# EAGLE design LEDs (EAGLE 9.6.2)
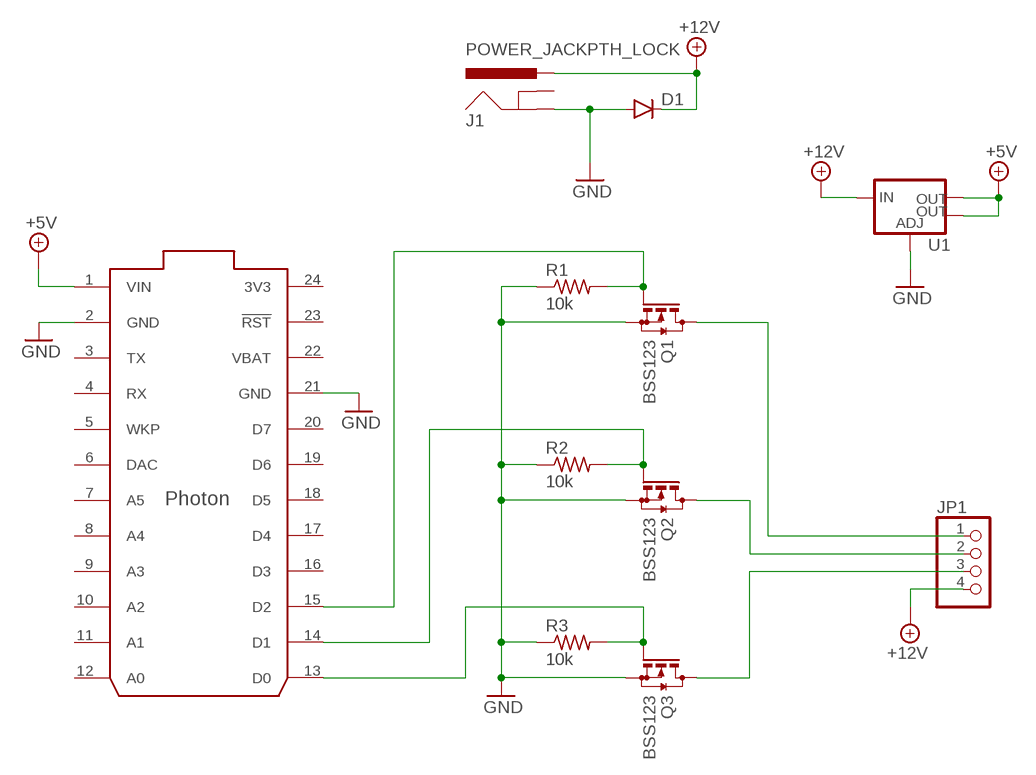
[diagram p0: schematic, sheet 1]

## Parts
D1  DIODESMA  [SMA-DIODE]
J1  POWER_JACKPTH_LOCK  [POWER_JACK_PTH_LOCK]
JP1  PINHD-1X4/90  [1X04/90]
Q1  BSS123  [SOT23]
Q2  BSS123  [SOT23]
Q3  BSS123  [SOT23]
R1  10k  R-US_M0805  [M0805]
R2  10k  R-US_M0805  [M0805]
R3  10k  R-US_M0805  [M0805]
U1  V_REG_LM1117SOT223  [SOT223]
U$1  PHOTON_WITH_HEADERS  [PHOTON]

## Nets
+5V: U1.2(OUT) U1.4(OUT) U$1.1(VIN)
+12V: D1.C J1.PWR JP1.4 U1.3(IN)
GND: D1.A J1.GND Q1.2(S) Q2.2(S) Q3.2(S) R1.1 R2.1 R3.1 U1.1(ADJ) U$1.2(GND) U$1.21(GND)
N$1: Q1.1(G) R1.2 U$1.15(D2)
N$2: Q2.1(G) R2.2 U$1.14(D1)
N$3: Q3.1(G) R3.2 U$1.13(D0)
N$4: JP1.3 Q3.3(D)
N$5: JP1.2 Q2.3(D)
N$6: JP1.1 Q1.3(D)
Unconnected: J1.GNDBREAK U$1.3(TX) U$1.4(RX) U$1.5(WKP) U$1.6(DAC) U$1.7(A5) U$1.8(A4) U$1.9(A3) U$1.10(A2) U$1.11(A1) U$1.12(A0) U$1.16(D3) U$1.17(D4) U$1.18(D5) U$1.19(D6) U$1.20(D7) U$1.23(!RST)

## Power pins joined to a net without a drawn wire
3V3: U$1.24(3V3)
VBAT: U$1.22(VBAT)

## Library data of the parts
D1 = SparkFun-DiscreteSemi:DIODE: Diode These are standard reverse protection diodes and small signal diodes. SMA package can handle up to about 1A. SOD-323 can handle about 200mA. What the SOD-323 package when ordering, there are some mfgs out there that are 5-pin packages.
J1 = Spark:POWER_JACK: Power Jack This is the standard 5.5mm barrel jack for power. The PTH is the most common, proven, reliable, footprint. The Slot footprint only works if the mill layer is transmitted to the PCB fab house so be warned. Spark Fun Electronics SKU : PRT-00119 SMT: CONN-08106 Mating wall wart : TOL-00298 (and others)
JP1 = pinhead:PINHD-1X4: PIN HEADER
Q1-Q3 = transistor-small-signal:BSS123: N-CHANNEL MOS FET
R1-R3 = resistor:R-US_: RESISTOR, American symbol
U1 = SparkFun-PowerIC:V_REG_LM1117: Voltage Regulator LM1117 Standard adjustable voltage regulator but in SMD form. Spark Fun Electronics SKU : COM-00595; PROD_ID: VREG-08170
U$1 = Spark:PHOTON

## Board
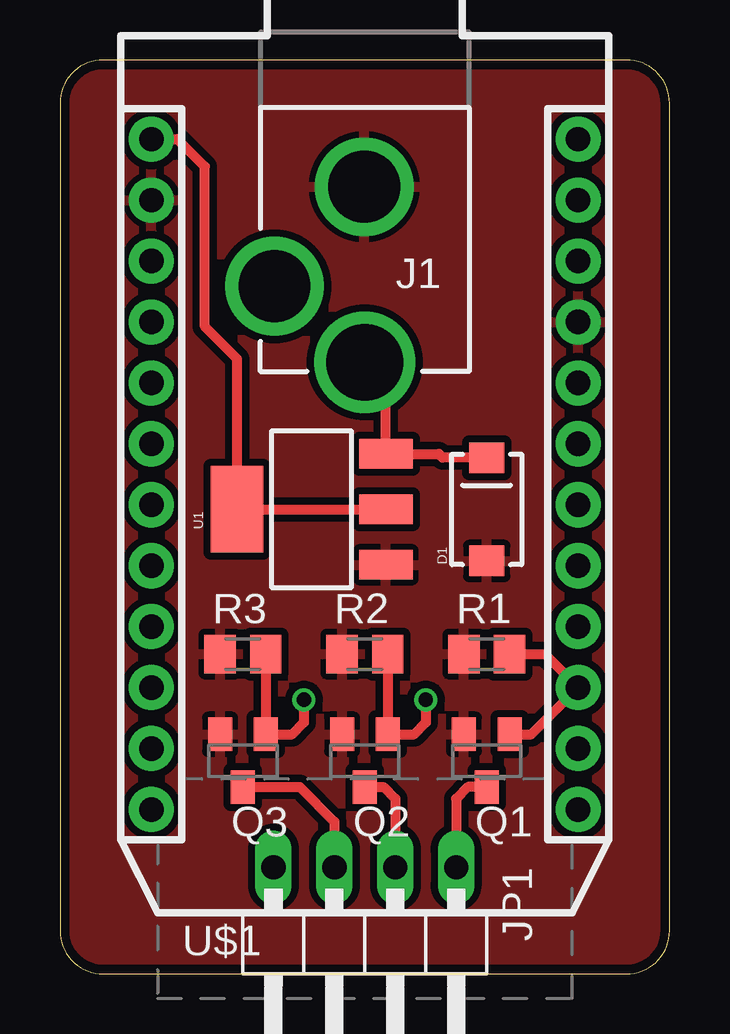
[diagram p1: board, top side]
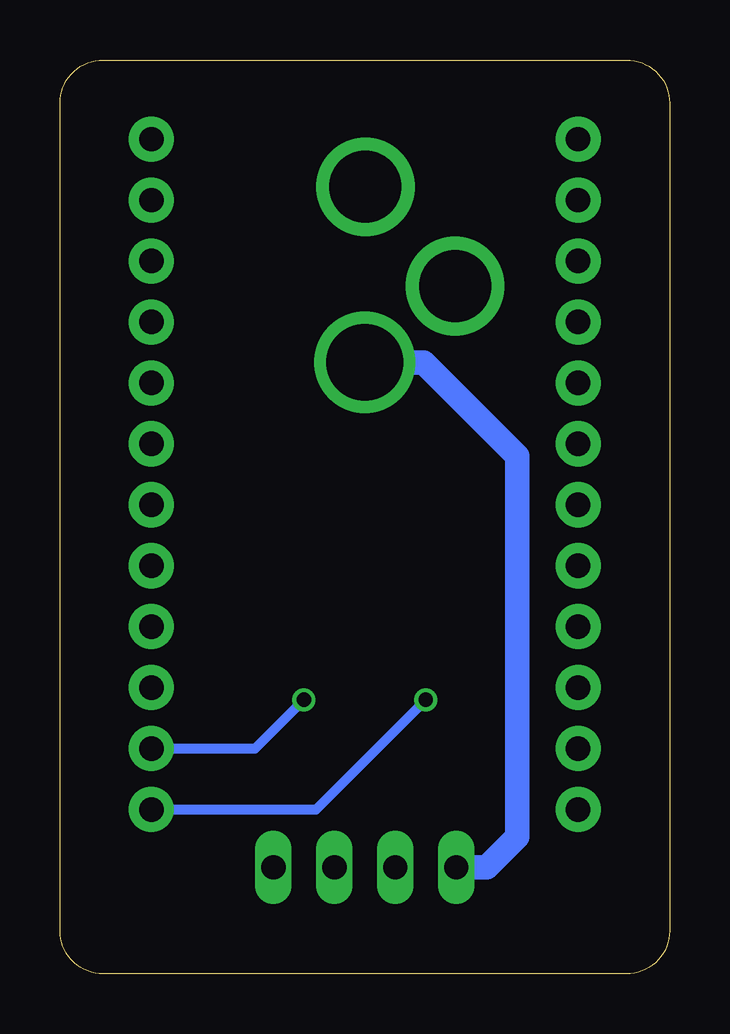
[diagram p2: board, bottom side, seen from below]

Size 25.4 x 38.1 mm. Coordinates in mm from the lower left corner, seen from the top.
Outline: 0,36.3 0,1.8 arc90 1.8,0 23.6,0 arc90 25.4,1.8 25.4,36.3 arc90 23.6,38.1 1.8,38.1 arc90 0,36.3
Copper layers (1*16): Top 0.0356mm / dielectric 1.5011mm / Bottom 0.0356mm
Design rules "LaenPCBOrder *": minimum track width 6mil, minimum drill 13mil, track to track 6mil, track to pad 6mil, pad to pad 6mil, via to via 6mil, smd to smd 6mil, copper to edge 15mil, drill to drill 6mil, minimum pad ring 7mil, minimum via ring 7mil, stop-mask expansion 3mil, vias tented up to drill 25mil, thermal gap 10mil

### Footprints (pad centres in the part's own frame; a part is rotated, then mirrored left to right if it is on the bottom)
SMA-DIODE = smd 1.27 x 1.47: A -2.15,0; C 2.15,0
POWER_JACK_PTH_LOCK = drill 2.997 pad 4.115: GND 0.025,6.557; GNDBREAK 3.762,10.7 | drill 3.2 pad 4.115: PWR 0,13.878
1X04/90 = drill 1.016 long: 1 -3.81,-3.81; 2 -1.27,-3.81; 3 1.27,-3.81; 4 3.81,-3.81
SOT23 = smd 1 x 1.4: 1 -0.95,-1.1; 2 0.95,-1.1; 3 0,1.1
M0805 = smd 1.3 x 1.6: 1 -0.95,0; 2 0.95,0
SOT223 = smd 1.219 x 2.235: 1 -2.311,-3.099; 2 0,-3.099; 3 2.311,-3.099 | smd 3.6 x 2.2: 4 0,3.099
PHOTON = drill 1.016 pad 1.88: 1 1.27,32.258; 2 1.27,29.718; 3 1.27,27.178; 4 1.27,24.638; 5 1.27,22.098; 6 1.27,19.558; 7 1.27,17.018; 8 1.27,14.478; 9 1.27,11.938; 10 1.27,9.398; 11 1.27,6.858; 12 1.27,4.318; 13 19.05,4.318; 14 19.05,6.858; 15 19.05,9.398; 16 19.05,11.938; 17 19.05,14.478; 18 19.05,17.018; 19 19.05,19.558; 20 19.05,22.098; 21 19.05,24.638; 22 19.05,27.178; 23 19.05,29.718; 24 19.05,32.258

### Placement (x,y rotation side)
D1  17.78,19.37 90 top
J1  12.7,39.37 180 top
JP1  12.7,0.64 180 top
Q1  17.78,8.89 180 top
Q2  12.7,8.89 180 top
Q3  7.62,8.89 180 top
R1  17.78,13.34 0 top
R2  12.7,13.34 0 top
R3  7.62,13.34 0 top
U1  10.48,19.37 90 top
U$1  2.54,2.54 0 top

### Tracks (layer width: path | path; a pad name or v marks a point on that pad's centre or on a via)
+5V
  Top 0.406: U1.2 U1.4 7.38,25.64 6.03,26.99 6.03,33.66 4.89,34.8 U$1.1
+12V
  Top 0.406: D1.C 15.95,21.52 15.79,21.68 U1.3 13.58,24.62 J1.PWR
  Bottom 1.016: JP1.4 7.62,4.45 6.35,5.71 6.35,21.59 10.25,25.49 J1.PWR
GND
  pour Top (isolate 0.305): 0,38.1 0,0 25.4,0 25.4,38.1
N$1
  Top 0.406: Q1.1 19.64,9.99 U$1.15 20.19,13.34 R1.2
N$2  (via drill 0.6)
  Top 0.406: R2.2 Q2.1 14.75,9.99 15.24,10.48 v15.24,11.43
  Bottom 0.406: U$1.14 17.27,9.4 v15.24,11.43
N$3  (via drill 0.6)
  Top 0.406: R3.2 Q3.1 9.67,9.99 10.16,10.48 v10.16,11.43
  Bottom 0.406: U$1.13 14.73,6.86 v10.16,11.43
N$4
  Top 0.406: Q3.3 9.99,7.79 11.43,6.35 JP1.3
N$5
  Top 0.406: Q2.3 13.48,7.79 13.97,7.3 JP1.2
N$6
  Top 0.406: Q1.3 17,7.79 16.51,7.3 JP1.1